# Altium schematic sheet Power_Management.SchDoc
size A4; DocumentNumber: 9; SheetNumber: 9; SheetTotal: 30
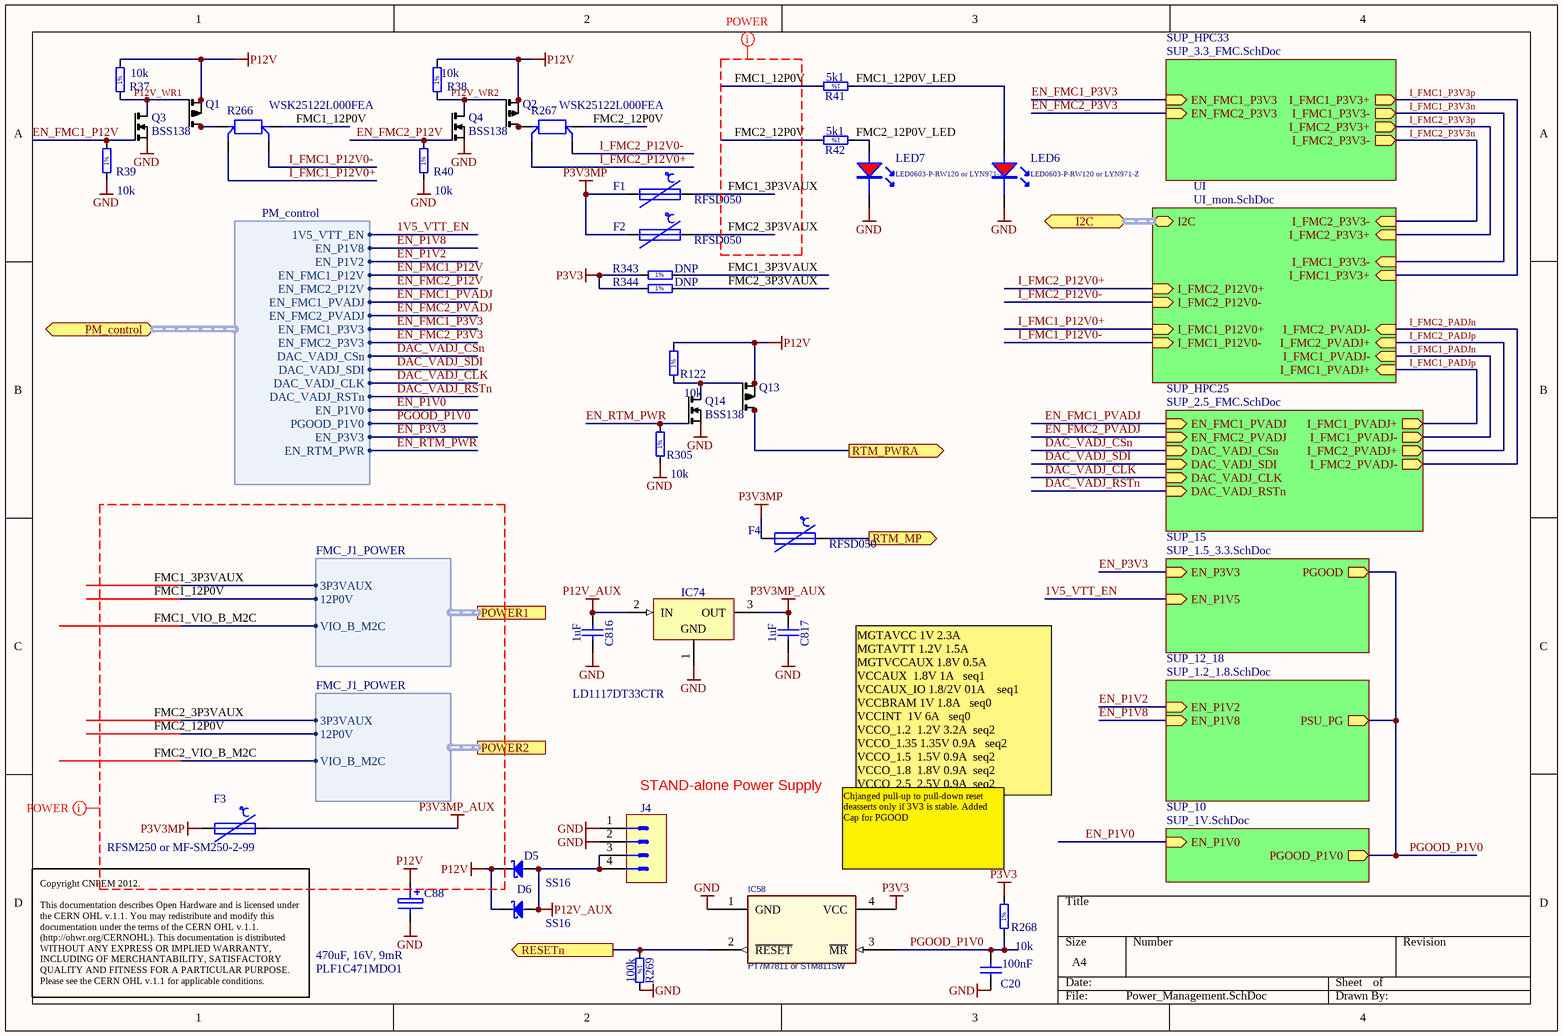
[diagram p0: Power_Management.SchDoc]

## Parts
C20  100nF  [CAPC0603X33N]
C88  PLF1C471MDO1  value 470uF, 16V, 9mR  [CAPPR500-1000X1250]
C816  1uF  [CAPC1608X87N]
C817  1uF  [CAPC1608X87N]
D5  SS16  [DIOM5127X229N]
D6  SS16  [DIOM5127X229N]
F1  RFSD050  [PTC_SMD_1812]
F2  RFSD050  [PTC_SMD_1812]
F3  RFSM250 or MF-SM250-2-99  [SMD150-2]
F4  RFSD050  [PTC_SMD_1812]
IC58  PT7M7811 or STM811SW  [SOT143B]
IC74  LD1117DT33CTR  [TO228P972X240-3N-R540X510]
J4  Mini-Fit Jr.™  [MOLEX_39-28-1043]  (value not drawn)
LED6  LED0603-P-RW120 or LYN971-Z  [led_0603R]
LED7  LED0603-P-RW120 or LYN971-Z  [led_0603R]
Q1  IRF9317PBF  or IRF9310PbF  [so-8]  (value not drawn)
Q2  IRF9317PBF  or IRF9310PbF  [so-8]  (value not drawn)
Q3  BSS138  [SOT95P251X112-3N]
Q4  BSS138  [SOT95P251X112-3N]
Q13  IRF9317PBF  or IRF9310PbF  [so-8]  (value not drawn)
Q14  BSS138  [SOT95P251X112-3N]
R37  10k  [RESC1005X40N]
R38  10k  [RESC1005X40N]
R39  10k  [RESC1005X40N]
R40  10k  [RESC1005X40N]
R41  5k1  [RESC1608X55N]
R42  5k1  [RESC1608X55N]
R122  10k  [RESC1005X40N]
R266  WSK25122L000FEA  [RES_WSK2512]
R267  WSK25122L000FEA  [RES_WSK2512]
R268  10k  [RESC1005X40N]
R269  100k  [RESC1005X40N]
R305  10k  [RESC1005X40N]
R343  DNP  [RESC1005X40N]
R344  DNP  [RESC1005X40N]

## Sub-sheets
SUP_10 = SUP_1V.SchDoc: PGOOD_P1V0 (out), EN_P1V0 (in)
SUP_12_18 = SUP_1.2_1.8.SchDoc: EN_P1V2 (in), EN_P1V8 (in), PSU_PG (out)
SUP_15 = SUP_1.5_3.3.SchDoc: PGOOD (out), EN_P1V5 (in), EN_P3V3 (in)
SUP_HPC25 = SUP_2.5_FMC.SchDoc: EN_FMC1_PVADJ (in), EN_FMC2_PVADJ (in), I_FMC1_PVADJ+ (out), I_FMC1_PVADJ- (out), I_FMC2_PVADJ+ (out), I_FMC2_PVADJ- (out), DAC_VADJ_CSn (in), DAC_VADJ_SDI (in), DAC_VADJ_CLK (in), DAC_VADJ_RSTn (in)
SUP_HPC33 = SUP_3.3_FMC.SchDoc: EN_FMC1_P3V3 (in), EN_FMC2_P3V3 (in), I_FMC1_P3V3+ (out), I_FMC1_P3V3- (out), I_FMC2_P3V3+ (out), I_FMC2_P3V3- (out)
UI = UI_mon.SchDoc: I_FMC2_P3V3- (in), I_FMC2_P3V3+ (in), I_FMC1_P3V3- (in), I_FMC1_P3V3+ (in), I_FMC1_PVADJ+ (in), I_FMC1_PVADJ- (in), I_FMC2_PVADJ+ (in), I_FMC2_PVADJ- (in), I_FMC2_P12V0+ (in), I_FMC2_P12V0- (in), I_FMC1_P12V0+ (in), I_FMC1_P12V0- (in), I2C (harness I2C)

## Ports
I2C (harness I2C), PM_control (harness PM_control), POWER1 (harness FMC_J1_POWER), POWER2 (harness FMC_J1_POWER), RESETn (out), RTM_MP (out), RTM_PWRA (out)

## Harnesses
FMC_J1_POWER: 3P3VAUX, 12P0V, VIO_B_M2C
PM_control: EN_P1V8, EN_P1V2, EN_FMC1_P12V, EN_FMC2_P12V, EN_FMC1_PVADJ, EN_FMC2_PVADJ, EN_FMC1_P3V3, EN_FMC2_P3V3, DAC_VADJ_CSn, DAC_VADJ_SDI, DAC_VADJ_CLK, DAC_VADJ_RSTn, 1V5_VTT_EN, EN_P1V0, PGOOD_P1V0, EN_P3V3, EN_RTM_PWR

## Nets
GND: C20.2 C88.2 C816.2 C817.2 IC58.1(GND) IC74.1(GND) J4.1 J4.2 LED6.K LED7.K Q3.2(S) Q4.2(S) Q14.2(S) R39.1 R40.1 R269.2 R305.1
P3V3: IC58.4(VCC) R268.2 R343.1 R344.1
P3V3MP: F1.1 F2.1 F3.1 F4.1
P3V3MP_AUX: C817.1 F3.2 IC74.3(OUT)
P12V: C88.1 D5.1(C) D6.1(C) Q1.1(S1) Q1.2(S1) Q1.3(S1) Q2.1(S1) Q2.2(S1) Q2.3(S1) Q13.1(S1) Q13.2(S1) Q13.3(S1) R37.2 R38.2 R122.2
P12V_AUX: C816.1 D5.2(A) D6.2(A) IC74.2(IN) J4.3 J4.4
1V5_VTT_EN: sheet SUP_15/EN_P1V5, port PM_control.1V5_VTT_EN
DAC_VADJ_CLK: sheet SUP_HPC25/DAC_VADJ_CLK, port PM_control.DAC_VADJ_CLK
DAC_VADJ_CSn: sheet SUP_HPC25/DAC_VADJ_CSn, port PM_control.DAC_VADJ_CSn
DAC_VADJ_RSTn: sheet SUP_HPC25/DAC_VADJ_RSTn, port PM_control.DAC_VADJ_RSTn
DAC_VADJ_SDI: sheet SUP_HPC25/DAC_VADJ_SDI, port PM_control.DAC_VADJ_SDI
EN_FMC1_P3V3: sheet SUP_HPC33/EN_FMC1_P3V3, port PM_control.EN_FMC1_P3V3
EN_FMC1_P12V: Q3.1(G) R39.2 ; port PM_control.EN_FMC1_P12V
EN_FMC1_PVADJ: sheet SUP_HPC25/EN_FMC1_PVADJ, port PM_control.EN_FMC1_PVADJ
EN_FMC2_P3V3: sheet SUP_HPC33/EN_FMC2_P3V3, port PM_control.EN_FMC2_P3V3
EN_FMC2_P12V: Q4.1(G) R40.2 ; port PM_control.EN_FMC2_P12V
EN_FMC2_PVADJ: sheet SUP_HPC25/EN_FMC2_PVADJ, port PM_control.EN_FMC2_PVADJ
EN_P1V0: sheet SUP_10/EN_P1V0, port PM_control.EN_P1V0
EN_P1V2: sheet SUP_12_18/EN_P1V2, port PM_control.EN_P1V2
EN_P1V8: sheet SUP_12_18/EN_P1V8, port PM_control.EN_P1V8
EN_P3V3: sheet SUP_15/EN_P3V3, port PM_control.EN_P3V3
EN_RTM_PWR: Q14.1(G) R305.2 ; port PM_control.EN_RTM_PWR
FMC1_3P3VAUX: F1.2 R343.2 ; port POWER1.3P3VAUX
FMC1_12P0V: R41.2 R266.2 ; port POWER1.12P0V
FMC1_12P0V_LED: LED6.A R41.1
FMC1_VIO_B_M2C: port POWER1.VIO_B_M2C
FMC2_3P3VAUX: F2.2 R344.2 ; port POWER2.3P3VAUX
FMC2_12P0V: R42.2 R267.2 ; port POWER2.12P0V
FMC2_12P0V_LED: LED7.A R42.1
FMC2_VIO_B_M2C: port POWER2.VIO_B_M2C
I_FMC1_P3V3n: sheet SUP_HPC33/I_FMC1_P3V3-, sheet UI/I_FMC1_P3V3-
I_FMC1_P3V3p: sheet SUP_HPC33/I_FMC1_P3V3+, sheet UI/I_FMC1_P3V3+
I_FMC1_P12V0+: R266.1a ; sheet UI/I_FMC1_P12V0+
I_FMC1_P12V0-: R266.2a ; sheet UI/I_FMC1_P12V0-
I_FMC1_PADJn: sheet SUP_HPC25/I_FMC1_PVADJ-, sheet UI/I_FMC1_PVADJ-
I_FMC1_PADJp: sheet SUP_HPC25/I_FMC1_PVADJ+, sheet UI/I_FMC1_PVADJ+
I_FMC2_P3V3n: sheet SUP_HPC33/I_FMC2_P3V3-, sheet UI/I_FMC2_P3V3-
I_FMC2_P3V3p: sheet SUP_HPC33/I_FMC2_P3V3+, sheet UI/I_FMC2_P3V3+
I_FMC2_P12V0+: R267.1a ; sheet UI/I_FMC2_P12V0+
I_FMC2_P12V0-: R267.2a ; sheet UI/I_FMC2_P12V0-
I_FMC2_PADJn: sheet SUP_HPC25/I_FMC2_PVADJ-, sheet UI/I_FMC2_PVADJ-
I_FMC2_PADJp: sheet SUP_HPC25/I_FMC2_PVADJ+, sheet UI/I_FMC2_PVADJ+
P12V_WR1: Q1.4(G1) Q3.3(D) R37.1
P12V_WR2: Q2.4(G1) Q4.3(D) R38.1
PGOOD_P1V0: C20.1 IC58.3(~{MR}) R268.1 ; sheet SUP_15/PGOOD, sheet SUP_12_18/PSU_PG, sheet SUP_10/PGOOD_P1V0, port PM_control.PGOOD_P1V0
RESETn: IC58.2(~{RESET}) R269.1 ; port RESETn
RTM_MP: F4.2 ; port RTM_MP
RTM_PWRA: Q13.5(D1) Q13.6(D1) Q13.7(D1) Q13.8(D1) ; port RTM_PWRA
NetQ1_5: Q1.5(D1) Q1.6(D1) Q1.7(D1) Q1.8(D1) R266.1
NetQ2_5: Q2.5(D1) Q2.6(D1) Q2.7(D1) Q2.8(D1) R267.1
NetQ13_4: Q13.4(G1) Q14.3(D) R122.1

## Buses and harness runs
harness port I2C = sheet UI/I2C

## Layout directives
net class POWER: FMC1_3P3VAUX, FMC1_12P0V, FMC1_VIO_B_M2C, FMC2_3P3VAUX, FMC2_12P0V, FMC2_VIO_B_M2C, P3V3MP, P3V3MP_AUX, P12V

## Notes on the sheet
- (near J4) STAND-alone Power Supply
- MGTAVCC	1V	2.3A
  MGTAVTT	1.2V	1.5A
  MGTVCCAUX	1.8V	0.5A
  VCCAUX		1.8V	1A			seq1
  VCCAUX_IO	1.8/2V	01A 			seq1
  VCCBRAM	1V	1.8A			seq0
  VCCINT		1V	6A			seq0
  VCCO_1.2		1.2V	3.2A		seq2
  VCCO_1.35	1.35V	0.9A			seq2
  VCCO_1.5		1.5V	0.9A		seq2
  VCCO_1.8		1.8V	0.9A		seq2
  VCCO_2.5		2.5V	0.9A		seq2
  VCCO_3.3		3.3V	0.9A		seq2
  power-on sequence is VCCINT, VCCBRAM, VCCAUX, and VCCO
  voltage difference between VCCO and VCCAUX must not exceed 2.625V for longer than TVCCO2VCCAUX
  power-on sequence to achieve minimum current draw for the GTP transceivers is VCCINT, VMGTAVCC,
  VMGTAVTT OR VMGTAVCC, VCCINT, VMGTAVTT. There is no recommended sequencing for VMGTVCCAUX. Both VMGTAVCC and
  VCCINT can be ramped simultaneously. The recommended power-off sequence is the reverse of the power-on sequence to
  achieve minimum current draw.
  When VMGTAVTT is powered before VMGTAVCC and VMGTAVTT – VMGTAVCC > 150 mV and VMGTAVCC < 0.7V, the
  VMGTAVTT current draw can increase by 460 mA per transceiver during VMGTAVCC ramp up. The duration of the current
  draw can be up to 0.3 x TMGTAVCC (ramp time from GND to 90% of VMGTAVCC). The reverse is true for power-down.
  • When VMGTAVTT is powered before VCCINT and VMGTAVTT – VCCINT > 150 mV and VCCINT < 0.7V, the VMGTAVTT current
  draw can increase by 50 mA per transceiver during VCCINT ramp up. The duration of the current draw can be up to
  0.3 x TVCCINT (ramp time from GND to 90% of VCCINT). The reverse is true for power-down.
- Chjanged pull-up to pull-down reset deasserts only if 3V3 is stable. Added Cap for PGOOD
- (near F3) Copyright CNPEM 2012.
  This documentation describes Open Hardware and is licensed under the CERN OHL v.1.1. You may redistribute and modify this documentation under the terms of the CERN OHL v.1.1. (http://ohwr.org/CERNOHL). This documentation is distributed WITHOUT ANY EXPRESS OR IMPLIED WARRANTY, INCLUDING OF MERCHANTABILITY, SATISFACTORY QUALITY AND FITNESS FOR A PARTICULAR PURPOSE. Please see the CERN OHL v.1.1 for applicable conditions.
- (in symbol R0402_0R_JUMPER) 1%
- (in symbol R0402_10K_1%_0.0625W_100PPM) 1%
- (in symbol R0402_100K_1%_0.0625W_100PPM) 1%
- (in symbol R0603_5K1_1%_0.1W_100PPM) 1%

## Library data of the parts
C20 = CC0201_100NF_6.3V_10%_X5R: Non-polarised capacitor; Part Description: SMD Multilayer Chip Ceramic Capacitor; Manufacturer: GENERIC; Manufacturer1 Part Number: 02016D104KAT2A; Voltage: 6.3V; TC: X5R; Tolerance: ±10%; Table: Capacitors SMD; Part Number: CC0201_100NF_6.3V_10%_X5R; Component Kind: Standard; Component Type: Standard; Pin Count: 2; Value: 100nF; Status: Not Recommended; Manufacturer Part Number: CC0201_100NF_6.3V_10%_X5R; Case: 0201; Mounted: Yes; Socket: No; SMD: Yes; Manufacturer1 Example: AVX; Manufacturer1 ComponentHeight: 0.33mm; HelpURL: \\cern.ch\dfs\Applications\Altium\Datasheets\CC0201_X5R_AVX.pdf; Author: CERN DEM JLC; CreateDate: 2007-12-03; LatestRevisionDate: 2007-12-03
C88 = CAP_POLYMER_10mm: POLY, 470uF, 16V, ESR: 9mR
C816 C817 = CC0603_1UF_16V_10%_X7R: Non-polarised capacitor; Part Description: SMD Multilayer Chip Ceramic Capacitor; Manufacturer: GENERIC; Manufacturer1 Part Number: 223824613663; Voltage: 16V; TC: X7R; Tolerance: ±10%; Table: Capacitors SMD; Part Number: CC0603_1UF_16V_10%_X7R; Component Kind: Standard; Component Type: Standard; Pin Count: 2; Value: 1uF; Status: Preferred; Manufacturer Part Number: CC0603_1uF_16V_10%_X7R; Case: 0603; Mounted: Yes; Socket: No; SMD: Yes; Manufacturer1 Example: PHYCOMP; Manufacturer1 ComponentHeight: 0.87mm; HelpURL: \\cern.ch\dfs\Applications\Altium\Datasheets\CC0805_X5R_PHYCOMP_HC.pdf; Author: CERN DEM JLC; CreateDate: 2007-12-03; LatestRevisionDate: 2007-12-03
D5 D6 = SS16: Schottky Diode; Part Description: Surface Mount Schottky Barrier Rectifier; Manufacturer: VISHAY GENERAL SEMICONDUCTOR; Voltage: 60V; Power: 1A; Table: Diodes; Part Number: SS16; Component Kind: Standard; Component Type: Standard; Device: SS16; PackageDescription: DO-214-AC Molded Diode, Body 5.1x2.7mm, IPC Medium Density; Manufacturer Part Number: SS16; Pin Count: 2; Case: DO-214AC; Mounted: Yes; Socket: No; SMD: Yes; ComponentHeight: 2.29mm; HelpURL: \\cern.ch\dfs\Applications\Altium\Datasheets\SS16.pdf; Author: CERN DEM JLC; CreateDate: 2008-07-15; LatestRevisionDate: 2010-08-23
F1 F2 F4 = F_PTC_1812: 0.50A/15V; Supplier 1: Newark; Supplier Part Number 1: 02J2716
F3 = F_PTC_9.5x6mm: 2.50A/15V; Supplier 1: Newark; Supplier Part Number 1: 61J7435
IC58 = VOLT_STM811: voltage supervisor; Supplier 1: Digi-Key; Supplier Part Number 1: 497-3348-2-ND
IC74 = LD1117DT33CTR: 3-Terminal Regulator 1=GND 2=IN 3=OUT; Part Description: 3.3V 800mA Low drop fixed and adjustable positive voltage regulators; Manufacturer: ST MICROELECTRONICS; Table: Regulators; Part Number: LD1117DT33CTR; Component Kind: Standard; Component Type: Standard; Device: LD1117DT33CTR; PackageDescription: DPAK TO-252, 2.28mm pitch; 2 pin, 9.725mm L X 6.10mm W X 2.40mm H body, IPC Medium Density; Manufacturer Part Number: LD1117DT33CTR; Pin Count: 3; Case: DPAK; Mounted: Yes; Socket: No; SMD: Yes; ComponentHeight: 2.4mm; HelpURL: \\cern.ch\dfs\Applications\Altium\Datasheets\LD1117DT33CTR.pdf; Author: CERN DEM JLC; CreateDate: 2011-06-08; LatestRevisionDate: 2011-06-08
J4 = MOLEX_39-28-1043: Connector 4 Male; Part Description: 4.20mm (.165") Pitch Mini-Fit Jr.™ Header, Dual Row, Vertical, without Snap-in Plastic Peg PCB Lock, 4 Circuits; Manufacturer: MOLEX; Part Number: MOLEX_39-28-1043; Component Kind: Standard; Component Type: Standard; Pin Count: 4; Family: Mini-Fit Jr.™; Mounted: Yes; Socket: No; SMD: No; Status: None; Manufacturer Part Number: 39-28-1043; ComponentHeight: 13.1mm; HelpURL: \\cern.ch\dfs\Applications\Altium\Datasheets\MOLEX_39-28-1043.pdf; Author: CERN DEM JLC; CreateDate: 2009-03-12; LatestRevisionDate: 2012-03-06; Table: MOLEX
LED6 LED7 = LED_0603R: LED 0603 red; Supplier 1: Newark; Supplier Part Number 1: 22M3004; Supplier 2: Newark; Supplier Part Number 2: 20M0618
Q1 Q2 Q13 = Q_IRF9310: PMOS 30V, 4.6mR, 20A, 2.5W
Q3 Q4 Q14 = Q_BSS138
R37-R40 R122 R268 R305 = R0402_10K_1%_0.0625W_100PPM: Resistor - 1%; Part Description: General Purpose Thick Film Chip Resistor; Manufacturer: GENERIC; Manufacturer1 Part Number: 232270671003L; TC: ±100ppm/°C; Table: Resistors SMD; Part Number: R0402_10K_1%_0.0625W_100PPM; Component Kind: Standard; Component Type: Standard; Pin Count: 2; Value: 10k; Status: Not recommended; Power: 0.0625W; Tolerance: ±1%; Manufacturer Part Number: R0402_10K_1%_0.0625W_100PPM; Case: 0402; Mounted: Yes; Socket: No; SMD: Yes; Manufacturer1 Example: YAGEO PHYCOMP; Manufacturer1 ComponentHeight: 0.4mm; HelpURL: \\cern.ch\dfs\Applications\Altium\Datasheets\R0402_Phycomp_RC0402.pdf; Author: CERN DEM JLC; CreateDate: 2007-12-03; LatestRevisionDate: 2012-10-17
R41 R42 = R0603_5K1_1%_0.1W_100PPM: Resistor - 1%; Part Description: General Purpose Thick Film Chip Resistor; Manufacturer: GENERIC; Manufacturer1 Part Number: NRC06F5101TRF; Power: 0.1W; TC: ±100ppm/°C; Table: Resistors SMD; Part Number: R0603_5K1_1%_0.1W_100PPM; Component Kind: Standard; Component Type: Standard; Pin Count: 2; Value: 5k1; Status: Preferred; Tolerance: ±1%; Manufacturer Part Number: R0603_5K1_1%_0.1W_100PPM; Case: 0603; Mounted: Yes; Socket: No; SMD: Yes; Manufacturer1 Example: NIC COMPONENT; Manufacturer1 ComponentHeight: 0.55mm; HelpURL: \\cern.ch\dfs\Applications\Altium\Datasheets\R0603_NIC_NRC.pdf; Author: CERN DEM JLC; CreateDate: 2007-12-03; LatestRevisionDate: 2008-03-13
R266 R267 = RES_POW_Kelvin: RESISTOR, METAL STRIP, 0.001 OHM 1%
R269 = R0402_100K_1%_0.0625W_100PPM: Resistor - 1%; Part Description: General Purpose Thick Film Chip Resistor; Manufacturer: GENERIC; Manufacturer1 Part Number: 232270671004L; TC: ±100ppm/°C; Table: Resistors SMD; Part Number: R0402_100K_1%_0.0625W_100PPM; Component Kind: Standard; Component Type: Standard; Pin Count: 2; Value: 100k; Status: Not recommended; Power: 0.0625W; Tolerance: ±1%; Manufacturer Part Number: R0402_100K_1%_0.0625W_100PPM; Case: 0402; Mounted: Yes; Socket: No; SMD: Yes; Manufacturer1 Example: YAGEO PHYCOMP; Manufacturer1 ComponentHeight: 0.4mm; HelpURL: \\cern.ch\dfs\Applications\Altium\Datasheets\R0402_Phycomp_RC0402.pdf; Author: CERN DEM JLC; CreateDate: 2007-12-03; LatestRevisionDate: 2012-10-17
R343 R344 = R0402_0R_JUMPER: Resistor - 1%; Part Description: 1A (0.05R Max DC Resistance) Zero Ohm Jumper; Manufacturer: GENERIC; Manufacturer1 Part Number: 232270591001L; Value: 0; Table: Resistors SMD; Part Number: R0402_0R_JUMPER; Component Kind: Standard; Component Type: Standard; Pin Count: 2; Status: Not recommended; Manufacturer Part Number: R0402_0R_JUMPER; Case: 0402; Mounted: Yes; Socket: No; SMD: Yes; Manufacturer1 Example: YAGEO PHYCOMP; Manufacturer1 ComponentHeight: 0.4mm; HelpURL: \\cern.ch\dfs\Applications\Altium\Datasheets\R0402_Phycomp_RC0402.pdf; Author: CERN DEM JLC; CreateDate: 2007-12-03; LatestRevisionDate: 2012-10-17